# EAGLE schematic Auri Electrical Overview-Andrew (EAGLE 9.5.0)
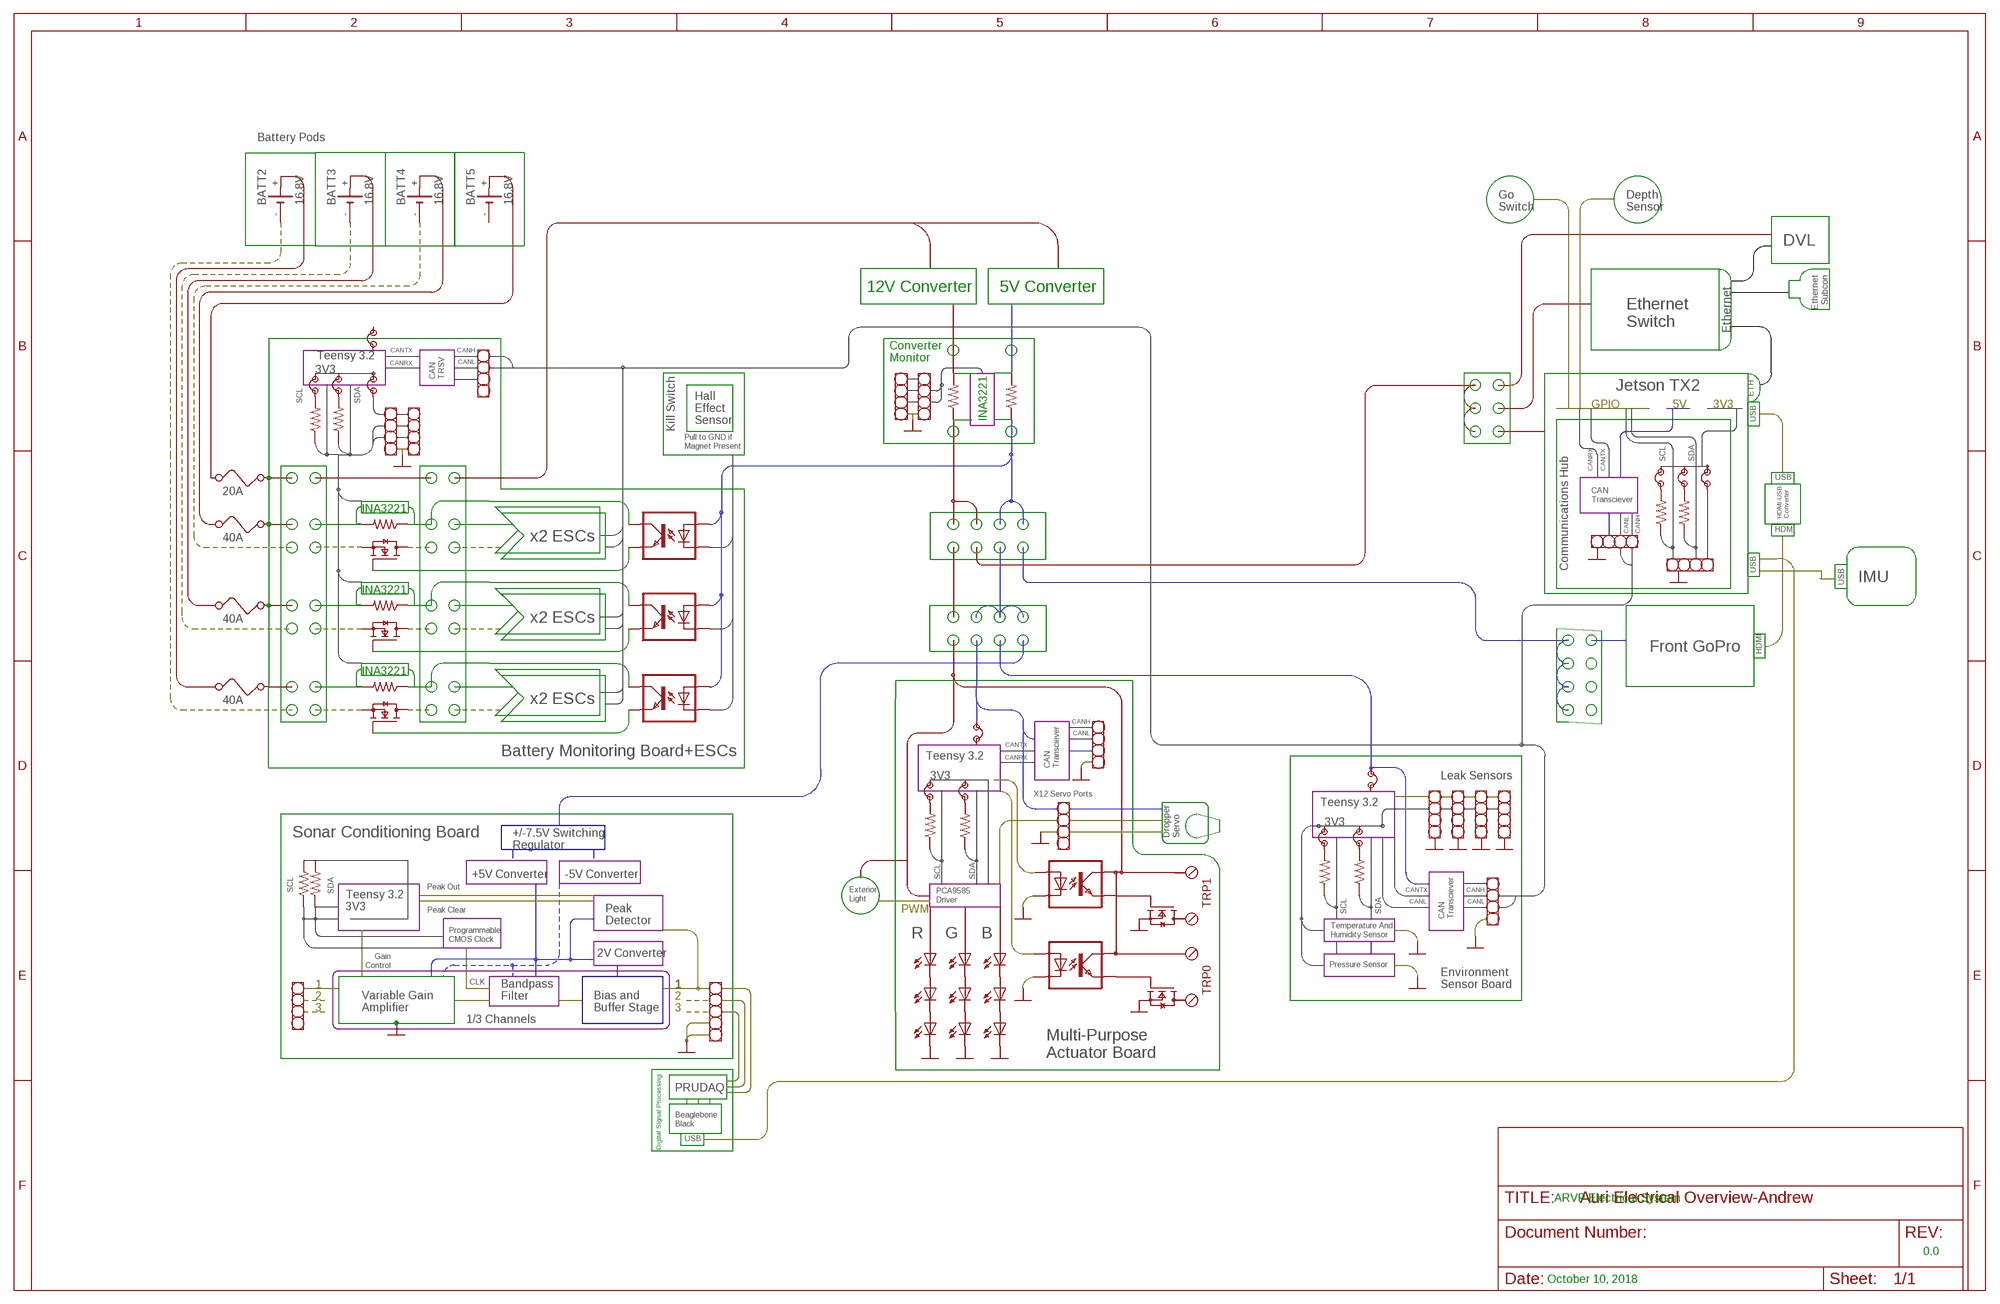
[diagram p0: schematic, sheet 1]

## Parts
40A  40A  FUSE  [FUSE]
40A1  40A  FUSE  [FUSE]
40A2  40A  FUSE  [FUSE]
40A3  20A  FUSE  [FUSE]
BATT2  16.8V  SL-340/P  [BEL/P]
BATT3  16.8V  SL-340/P  [BEL/P]
BATT4  16.8V  SL-340/P  [BEL/P]
BATT5  16.8V  SL-340/P  [BEL/P]
LED1  LED  [SMARTLED-TTW]
LED2  LED  [SMARTLED-TTW]
LED3  LED  [SMARTLED-TTW]
LED4  LED  [SMARTLED-TTW]
LED5  LED  [SMARTLED-TTW]
LED6  LED  [SMARTLED-TTW]
LED7  LED  [SMARTLED-TTW]
LED8  LED  [SMARTLED-TTW]
LED9  LED  [SMARTLED-TTW]
R1  R-US_R0603  [R0603]
R2  R-US_R0603  [R0603]
R3  R-US_R0402  [R0402]
R4  R-US_R0402  [R0402]
R5  R-US_R0402  [R0402]
R6  R-US_R0402  [R0402]
R7  R-US_R0402  [R0402]
R8  R-US_R0402  [R0402]
R9  R-US_R0603  [R0603]
R10  R-US_R0603  [R0603]
R11  R-US_R0603  [R0603]
R12  R-US_R0402  [R0402]
R13  R-US_R0402  [R0402]
R14  R-US_R0402  [R0402]
R15  R-US_R0402  [R0402]
T1  2N7002E  [SOT23]
T2  2N7002E  [SOT23]
T3  2N7002E  [SOT23]
T4  2N7002E  [SOT23]
T5  2N7002E  [SOT23]
TRM1  OSTTC022162  [OSTTC022162]
TRM2  OSTTC022162  [OSTTC022162]
TRM3  OSTTC022162  [OSTTC022162]
TRM4  OSTTC022162  [OSTTC022162]
U1  LTV-355T  [SMD4]
U2  LTV-355T  [SMD4]
U3  LTV-355T  [SMD4]
U4  LTV-355T  [SMD4]
U5  LTV-355T  [SMD4]
U$2  PIN-HEADER  [PIN-HEADER]
U$3  PIN-HEADER  [PIN-HEADER]
U$9  PIN-HEADER  [PIN-HEADER]
U$10  PIN-HEADER  [PIN-HEADER]
U$11  PIN-HEADER  [PIN-HEADER]
U$12  PIN-HEADER  [PIN-HEADER]
U$13  PIN-HEADER  [PIN-HEADER]
U$15  PIN-HEADER  [PIN-HEADER]
U$16  PIN-HEADER-5  [PIN-HEADER-4]
U$19  PIN-HEADER  [PIN-HEADER]
U$20  PIN-HEADER-4  [PIN-HEADER-4]
U$21  PIN-HEADER-4  [PIN-HEADER-4]
U$23  PIN-HEADER-4  [PIN-HEADER-4]
U$24  PIN-HEADER-4  [PIN-HEADER-4]
U$25  PIN-HEADER  [PIN-HEADER]
U$28  PIN-HEADER  [PIN-HEADER]

## Nets
GND: LED3.C@1(C) LED6.C@1(C) LED9.C@1(C) T1.2(S) T2.2(S)
N$2: R10.2
N$6: T4.1(G) U4.EMITTER(EMIT)
N$9: U3.COLLECTOR(COL)
N$10: U4.COLLECTOR(COL)
N$11: U5.COLLECTOR(COL)
N$14: T3.1(G) U3.EMITTER(EMIT)
N$16: R9.1
N$17: R9.2
N$19: R10.1
N$21: R11.1
N$23: R1.2
N$24: R1.1
N$26: R2.2
N$27: R2.1
N$31: LED1.C@1(C) LED2.A@1(A)
N$32: LED2.C@1(C) LED3.A@1(A)
N$33: LED4.C@1(C) LED5.A@1(A)
N$34: LED5.C@1(C) LED6.A@1(A)
N$35: LED7.C@1(C) LED8.A@1(A)
N$36: LED8.C@1(C) LED9.A@1(A)
N$46: T5.1(G) U5.EMITTER(EMIT)
N$47: R11.2
N$49: 40A1.2 40A2.2 40A3.2 40A.2
Unconnected: 40A1.1 40A2.1 40A3.1 40A.1 BATT2.+ BATT2.- BATT3.+ BATT3.- BATT4.+ BATT4.- BATT5.+ BATT5.- LED1.A@1(A) LED4.A@1(A) LED7.A@1(A) R3.1 R3.2 R4.1 R4.2 R5.1 R5.2 R6.1 R6.2 R7.1 R7.2 R8.1 R8.2 R12.1 R12.2 R13.1 R13.2 R14.1 R14.2 R15.1 R15.2 T1.1(G) T1.3(D) T2.1(G) T2.3(D) T3.2(S) T3.3(D) T4.2(S) T4.3(D) T5.2(S) T5.3(D) TRM1.1 TRM1.2 TRM2.1 TRM2.2 TRM3.1 TRM3.2 TRM4.1 TRM4.2 U1.ANODE(A) U1.CATHODE(C) U1.COLLECTOR(COL) U1.EMITTER(EMIT) U2.ANODE(A) U2.CATHODE(C) U2.COLLECTOR(COL) U2.EMITTER(EMIT) U3.ANODE(A) U3.CATHODE(C) U4.ANODE(A) U4.CATHODE(C) U5.ANODE(A) U5.CATHODE(C)

## Buses
B$1
B$2

## Notes on the sheet
- Battery Pods
- Go 
  Switch
- Depth
  Sensor
- DVL
- Ethernet
  Subcon
- 12V Converter | 5V Converter
- Ethernet
  Switch
- Ethernet
- CANTX | CANH
- Teensy 3.2 | CANRX | CANL
- Converter 
  Monitor
- 3V3
- CAN
  TRSV
- Jetson TX2
- ETH
- SCL | SDA
- GPIO | 5V | 3V3
- INA3221 | USB
- Hall
  Effect
  Sensor
- Kill Switch
- Pull to GND if
  Magnet Present
- SCL | SDA
- CANRX | CANTX
- USB
- CAN
  Transciever
- INA3221
- HDMI-USB
  Converter
- CANL | CANH | HDMI
- x2 ESCs
- USB
- Communications Hub | USB
- IMU
- INA3221
- x2 ESCs
- Front GoPro | HDMI
- INA3221
- x2 ESCs
- CANH
- CANL
- CANTX
- Battery Monitoring Board+ESCs | CANRX
- Teensy 3.2
- CAN
  Transciever
- 3V3 | Leak Sensors
- X12 Servo Ports
- Teensy 3.2
- 3V3
- Sonar Conditioning Board
- Dropper
  Servo
- +/-7.5V Switching 
  Regulator
- SCL | SDA | +5V Converter | -5V Converter | TRP1
- SCL | SDA
- Peak Out
- CANTX | CANH
- CANL | CANL
- Exterior
  Light
- PCA9585
  Driver
- Peak Clear
- Teensy 3.2
  3V3
- PWM | SCL | SDA
- CAN
  Transciever
- Peak 
  Detector
- R | G | B
- Temperature And 
  Humidity Sensor
- Programmable 
  CMOS Clock
- Gain
  Control
- 2V Converter
- TRP0
- Pressure Sensor
- CLK
- 1 | 1 | 1 | 1 | 1 | 1
- Environment 
  Sensor Board
- 2
- Bandpass
  Filter
- 2
- 3
- Variable Gain
  Amplifier
- Bias and 
  Buffer Stage
- 3
- 1/3 Channels
- Multi-Purpose 
  Actuator Board
- Digital Signal Processing
- PRUDAQ
- Beaglebone
  Black
- USB
- ARVP Electrical System
- 0.0
- October 10, 2018

## Library data of the parts
40A 40A1-40A3 = special:FUSE: FUSE 5 x 20 mm
BATT2-BATT5 = battery:SL-340/P: LI BATTERY Sonnenschein SL-340
LED1-LED9 = led:LED: LED OSRAM: - CHIPLED LG R971, LG N971, LY N971, LG Q971, LY Q971, LO R971, LY R971 LH N974, LH R974 LS Q976, LO Q976, LY Q976 LO Q996 - Hyper CHIPLED LW Q18S LB Q993, LB Q99A, LB R99A - SideLED LS A670, LO A670, LY A670, LG A670, LP A670 LB A673, LV A673, LT A673, LW A673 LH A674 LY A675 LS A676, LA A676, LO A676, LY A676, LW A676 LS A679, LY A679, LG A679 - Hyper Micro SIDELED® LS Y876, LA Y876, LO Y876, LY Y876 LT Y87S - SmartLED LW L88C, LW L88S LB L89C, LB L89S, LG L890 LS L89K, LO L89K, LY L89K LS L896, LA L896, LO L896, LY L896 - TOPLED LS T670, LO T670, LY T670, LG T670, LP T670 LSG T670, LSP T670, LSY T670, LOP T670, LYG T670 LG T671, LOG T671, LSG T671 LB T673, LV T673, LT T673, LW T673 LH T674 LS T676, LA T676, LO T676, LY T676, LB T676, LH T676, LSB T676, LW T676 LB T67C, LV T67C, LT T67C, LS T67K, LO T67K, LY T67K, LW E67C LS E67B, LA E67B, LO E67B, LY E67B, LB E67C, LV E67C, LT E67C LW T67C LS T679, LY T679, LG T679 LS T770, LO T770, LY T770, LG T770, LP T770 LB T773, LV T773, LT T773, LW T773 LH T774 LS E675, LA E675, LY E675, LS T675 LS T776, LA T776, LO T776, LY T776, LB T776 LHGB T686 LT T68C, LB T68C - Hyper Mini TOPLED® LB M676 - Mini TOPLED Santana® LG M470 LS M47K, LO M47K, LY M47K Source: http://www.osram.convergy.de LUXEON: - LUMILED® LXK2-PW12-R00, LXK2-PW12-S00, LXK2-PW14-U00, LXK2-PW14-V00 LXK2-PM12-R00, LXK2-PM12-S00, LXK2-PM14-U00 LXK2-PE12-Q00, LXK2-PE12-R00, LXK2-PE12-S00, LXK2-PE14-T00, LXK2-PE14-U00 LXK2-PB12-K00, LXK2-PB12-L00, LXK2-PB12-M00, LXK2-PB14-N00, LXK2-PB14-P00, LXK2-PB14-Q00 LXK2-PR12-L00, LXK2-PR12-M00, LXK2-PR14-Q00, LXK2-PR14-R00 LXK2-PD12-Q00, LXK2-PD12-R00, LXK2-PD12-S00 LXK2-PH12-R00, LXK2-PH12-S00 LXK2-PL12-P00, LXK2-PL12-Q00, LXK2-PL12-R00 Source: www.luxeon.com KINGBRIGHT: KA-3528ASYC Source: www.kingbright.com
R1-R15 = audio amplifier example:R-US_: RESISTOR, American symbol
T1-T5 = nxp_60:2N7002: N-channel TrenchMOS FET N-channel enhancement mode Field-Effect Transistor (FET) in a plastic package using TrenchMOS technology. AAL Eindhoven MK
TRM1-TRM4 = dropper_torpedo_v3:OSTTC022162
U1-U5 = dropper_torpedo_v3:LTV-355T
U$2 U$3 U$9-U$13 U$15 U$19 U$25 U$28 = My Library:PIN-HEADER
U$16 = My Library:PIN-HEADER-5
U$20 U$21 U$23 U$24 = My Library:PIN-HEADER-4